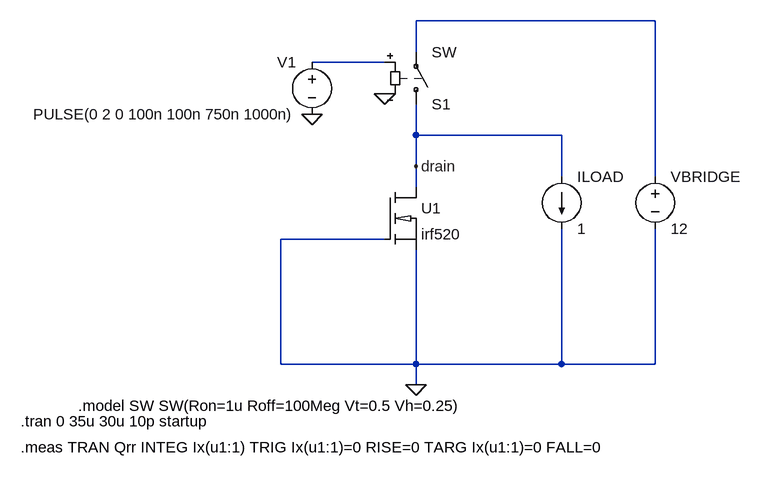
[diagram p0: schematic tb_rr_charge.asc]
tb_rr_charge.asc, the LTspice schematic file:
Version 4
SHEET 1 880 680
WIRE 720 -160 352 -160
WIRE 352 -112 352 -160
WIRE 304 -96 192 -96
WIRE 352 16 352 -32
WIRE 576 16 352 16
WIRE 352 64 352 16
WIRE 576 80 576 16
WIRE 720 80 720 -160
WIRE 352 96 352 64
WIRE 304 176 144 176
WIRE 144 368 144 176
WIRE 352 368 352 192
WIRE 352 368 144 368
WIRE 576 368 576 160
WIRE 576 368 352 368
WIRE 720 368 720 160
WIRE 720 368 576 368
WIRE 352 400 352 368
FLAG 352 400 0
FLAG 352 64 drain
FLAG 304 -48 0
FLAG 192 -16 0
SYMBOL sw 352 -16 M180
SYMATTR InstName S1
SYMBOL voltage 192 -112 M0
WINDOW 123 0 0 Left 0
WINDOW 39 0 0 Left 0
SYMATTR InstName V1
SYMATTR Value PULSE(0 2 0 100n 100n 750n 1000n)
SYMBOL current 576 80 R0
WINDOW 123 0 0 Left 0
WINDOW 39 0 0 Left 0
SYMATTR InstName ILOAD
SYMATTR Value 1
SYMBOL voltage 720 64 R0
WINDOW 123 0 0 Left 0
WINDOW 39 0 0 Left 0
SYMATTR InstName VBRIDGE
SYMATTR Value 12
SYMBOL irf520 304 96 R0
SYMATTR InstName U1
TEXT -168 432 Left 2 !.model SW SW(Ron=1u Roff=100Meg Vt=0.5 Vh=0.25)
TEXT -256 456 Left 2 !.tran 0 35u 30u 10p startup
TEXT -256 496 Left 2 !.meas TRAN Qrr INTEG Ix(u1:1) TRIG Ix(u1:1)=0 RISE=0 TARG Ix(u1:1)=0 FALL=0

The netlist it stands for:
* tb_rr_charge.asc
S1 drain N001 N002 0 SW
V1 N002 0 PULSE(0 2 0 100n 100n 750n 1000n)
ILOAD drain 0 1
VBRIDGE N001 0 12
XU1 drain 0 0 irf520
.model SW SW(Ron=1u Roff=100Meg Vt=0.5 Vh=0.25)
.tran 0 35u 30u 10p startup
.meas TRAN Qrr INTEG Ix(u1:1) TRIG Ix(u1:1)=0 RISE=0 TARG Ix(u1:1)=0 FALL=0
.lib irf520.txt
.backanno
.end